# Altium schematic sheet bithd_razor.SchDoc
size A1; PageSetup: Record=PageOptions|CenterHorizontal=True|CenterVertical=True|PrintScale=1.00|XCorrection=1.00|YCorrection=1.00|PrintKind=1|BorderSize=5000000|LeftOffset=0|BottomOffset=0|Orientation=2|PaperLength=1000|PaperWidth=1000|Scale=100|PaperSource=7|PrintQuality=-4|MediaType=1|DitherType=10|PaperKind=A4|PrintScaleMode=0
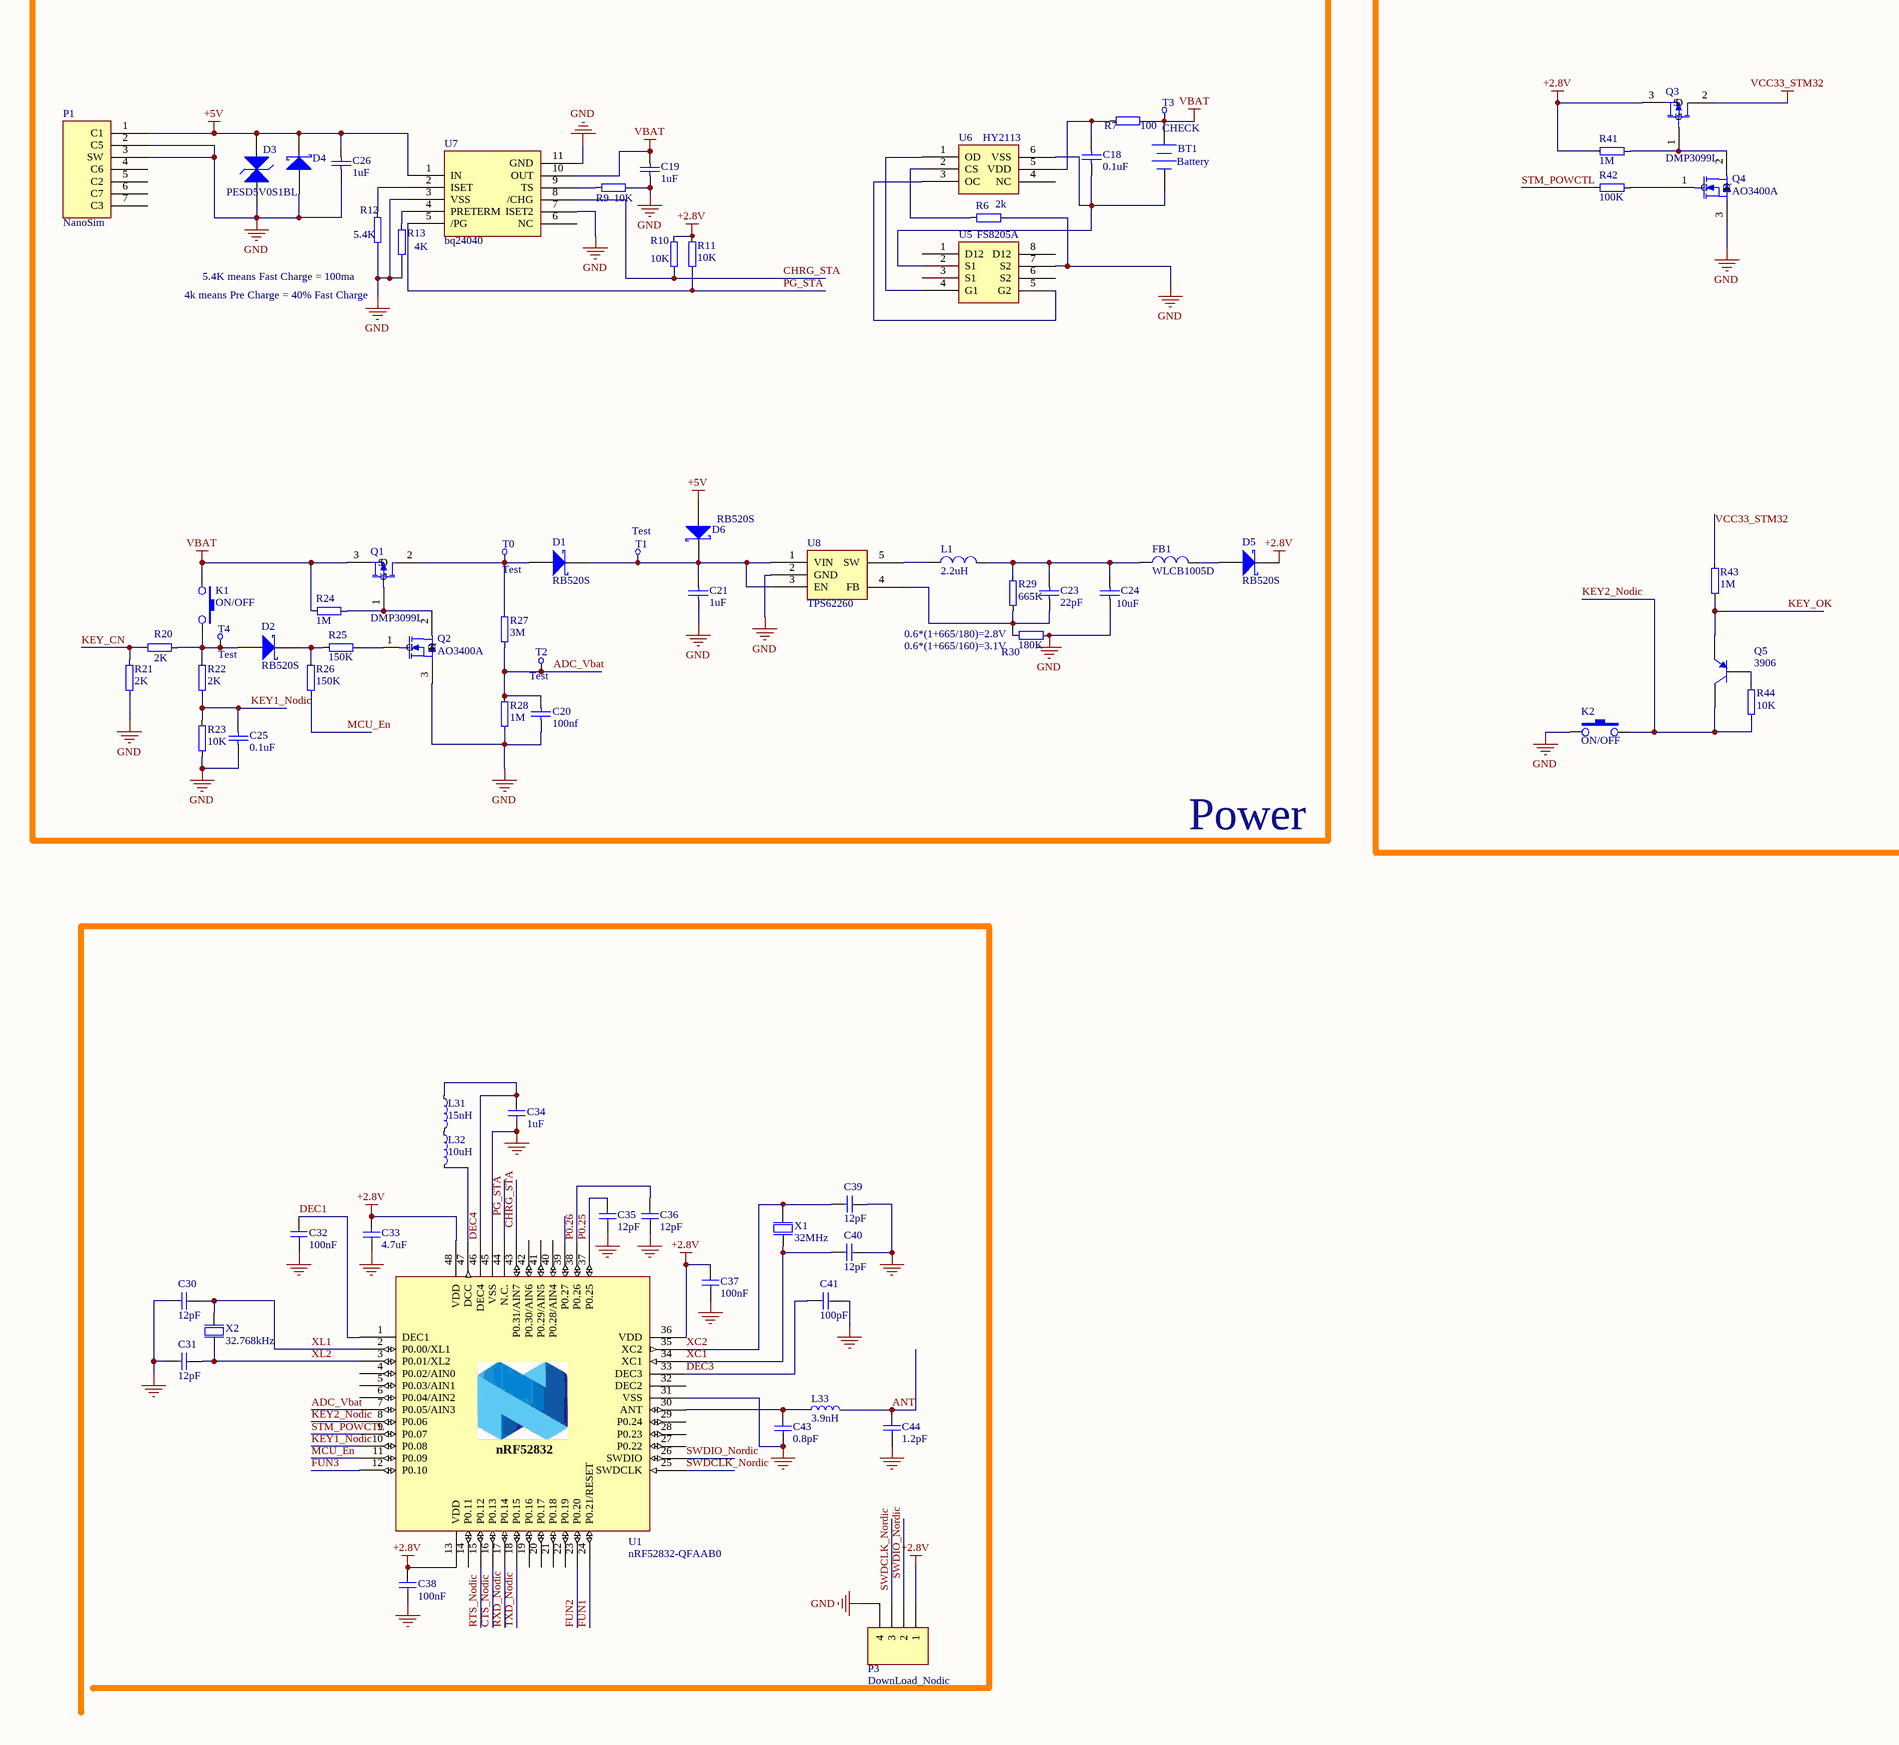
[diagram p0: bithd_razor.SchDoc, left]
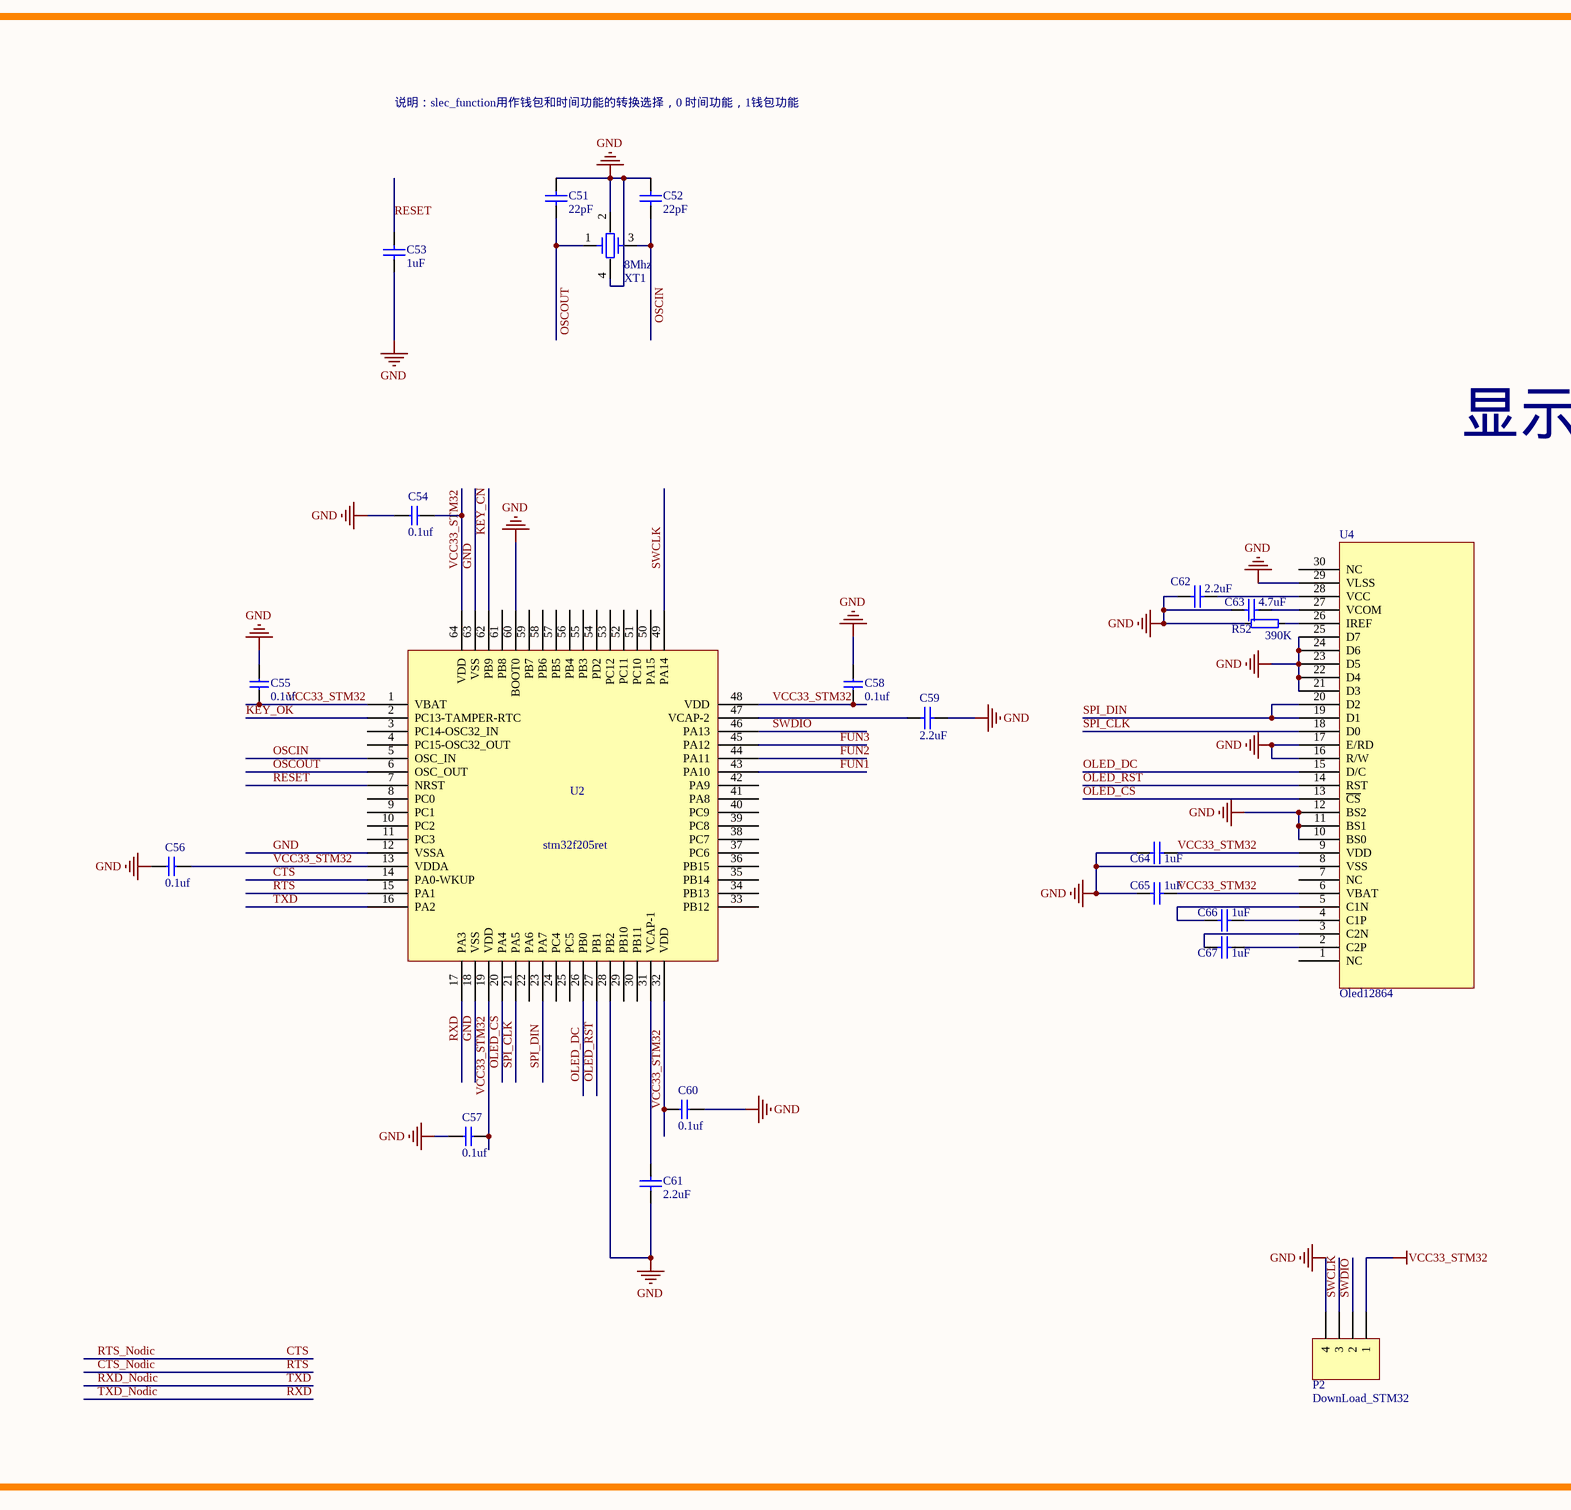
[diagram p1: bithd_razor.SchDoc, right]

## Parts
BT1  Battery  [BAT_302135]
C18  0.1uF  [0402-c]
C19  1uF  [C-RAD-0603]
C20  100nf  [0402-c]
C21  1uF  [C-RAD-0603]
C23  22pF  [0402-c]
C24  10uF  [C-RAD-0603]
C25  0.1uF  [0402-c]
C26  1uF  [C-RAD-0603]
C30  12pF  [0402-c]
C31  12pF  [0402-c]
C32  100nF  [0402-c]
C33  4.7uF  [C-RAD-0603]
C34  1uF  [C-RAD-0603]
C35  12pF  [0402-c]
C36  12pF  [0402-c]
C37  100nF  [0402-c]
C38  100nF  [0402-c]
C39  12pF  [0402-c]
C40  12pF  [0402-c]
C41  100pF  [0402-c]
C43  0.8pF  [0402-c]
C44  1.2pF  [0402-c]
C51  22pF  [0402-c]
C52  22pF  [0402-c]
C53  1uF  [C-RAD-0603]
C54  0.1uf  [0402-c]
C55  0.1uf  [0402-c]
C56  0.1uf  [0402-c]
C57  0.1uf  [0402-c]
C58  0.1uf  [0402-c]
C59  2.2uF  [C-RAD-0603]
C60  0.1uf  [0402-c]
C61  2.2uF  [C-RAD-0603]
C62  2.2uF  [C-RAD-0603]
C63  4.7uF  [C-RAD-0603]
C64  1uF  [C-RAD-0603]
C65  1uF  [C-RAD-0603]
C66  1uF  [C-RAD-0603]
C67  1uF  [C-RAD-0603]
D1  RB520S  [SOD523]
D2  RB520S  [SOD523]
D3  PESD5V0S1BL  [SOD882]
D4  PZU5.6B  [SOD323]  (value not drawn)
D5  RB520S  [SOD523]
D6  RB520S  [SOD523]
FB1  WLCB1005D  [0603-1]
K1  ON/OFF  [SMALL_KEY]
K2  ON/OFF  [SMALL_KEY]
L1  2.2uH  [0603-1]
L31  15nH  [INDC1005X04L]
L32  10uH  [0603-1]
L33  3.9nH  [INDC1005X04L]
P1  NanoSim  [NANOSIM1]
P2  DownLoad_STM32  [SWD_CON]
P3  DownLoad_Nodic  [SWD_CON]
Q1  DMP3099L  [SOT-23]
Q2  AO3400A  [SOT-23]
Q3  DMP3099L  [SOT-23]
Q4  AO3400A  [SOT-23]
Q5  3906  [SOT523]
R6  2k  [0402-A]
R7  100  [0402-A]
R9  10K  [0402-A]
R10  10K  [0402-A]
R11  10K  [0402-A]
R12  5.4K  [0402-A]
R13  4K  [0402-A]
R20  2K  [0402-A]
R21  2K  [0402-A]
R22  2K  [0402-A]
R23  10K  [0402-A]
R24  1M  [0402-A]
R25  150K  [0402-A]
R26  150K  [0402-A]
R27  3M  [0402-A]
R28  1M  [0402-A]
R29  665K  [0402-A]
R30  180K  [0402-A]
R41  1M  [0402-A]
R42  100K  [0402-A]
R43  1M  [0402-A]
R44  10K  [0402-A]
R52  390K  [0402-A]
T0  Test  [TEST_P]
T1  Test  [TEST_P]
T2  Test  [TEST_P]
T3  CHECK  [TEST_P]
T4  Test  [TEST_P]
U1  nRF52832-QFAAB0  [QFN40P600X600X90-48N]
U2  stm32f205ret  [LQFP-64]
U4  Oled12864  [oled12864_reverse]
U5  FS8205A  [TSSOP-8]
U6  HY2113  [SOT23-6]
U7  bq24040  [WSON-10]
U8  TPS62260  [SOT23-5]
X1  32MHz  [BT-XTAL_2016]
X2  32.768kHz  [XTAL_3215]
XT1  8Mhz  [SMD3225]

## Blocks framed on the sheet
Power: BT1 C18-C21 C23-C26 D1-D6 FB1 K1 L1 P1 Q1 Q2 R6 R7 R9-R13 R20-R30 T0-T4 U5-U8

## Nets
+2.8V: C33.1 C37.2 C38.2 D5.2(K) P3.1 Q3.3(S) R10.2 R11.1 R41.2 U1.13(VDD) U1.36(VDD) U1.48(VDD)
+5V: C26.1 D3.2(K) D4.2(K) D6.1(A) P1.1(C1) U7.1(IN)
GND: C19.2 C20.1 C21.1 C24.2 C25.1 C26.2 C30.2 C31.2 C32.1 C33.2 C34.1 C35.1 C36.1 C37.1 C38.1 C39.1 C40.2 C41.1 C43.2 C44.1 C51.1 C52.2 C53.1 C54.1 C55.1 C56.1 C57.2 C58.1 C59.1 C60.1 C61.1 C62.1 C63.1 C64.1 C65.1 D3.1(A) D4.1(A) K2.1 P1.2(C5) P1.3(SW) P2.4 P3.4 Q2.3(S) Q4.3(S) R6.1 R9.1 R12.2 R13.1 R21.1 R23.1 R28.1 R30.1 R52.1 U1.31(VSS) U1.45(VSS) U1.49(GND) U2.12(VSSA) U2.18(VSS) U2.28(PB2) U2.60(BOOT0) U2.63(VSS) U4.8(VSS) U4.10(BS0) U4.11(BS1) U4.12(BS2) U4.16(R/W) U4.17(E/RD) U4.21(D3) U4.22(D4) U4.23(D5) U4.24(D6) U4.25(D7) U4.29(VLSS) U5.7(S2) U7.3(VSS) U7.7(ISET2) U7.11(GND) U8.2(GND) X1.2(GND) X1.4(GND) XT1.2 XT1.4
VBAT: BT1.1(+) C19.1 K1.1 Q1.3(S) R7.2 R24.2 T3.1 U7.10(OUT)
VCC33_STM32: C54.2 C55.2 C56.2 C57.1 C58.2 C60.2 C64.2 C65.2 P2.1 Q3.2(D) R43.2 U2.1(VBAT) U2.13(VDDA) U2.19(VDD) U2.32(VDD) U2.48(VDD) U2.64(VDD) U4.6(VBAT) U4.9(VDD)
ADC_Vbat: C20.2 R27.2 R28.2 T2.1 U1.7(P0.05/AIN3)
ANT: C44.2 L33.2
CHRG_STA: R10.1 U1.43(P0.31/AIN7) U7.8(/CHG)
CTS: U1.15(P0.12) U2.14(PA0-WKUP)  [also labelled RTS_Nodic]
CTS_Nodic: U1.16(P0.13) U2.15(PA1)  [also labelled RTS]
DEC1: C32.2 U1.1(DEC1)
DEC3: C41.2 U1.33(DEC3)
DEC4: C34.2 L31.1 U1.46(DEC4)
FUN1: U1.24(P0.21/RESET) U2.43(PA10)
FUN2: U1.23(P0.20) U2.44(PA11)
FUN3: U1.12(P0.10) U2.45(PA12)
KEY1_Nodic: C25.2 R22.1 R23.2 U1.10(P0.08)
KEY2_Nodic: K2.2 Q5.3(C) R44.2 U1.8(P0.06)
KEY_CN: R20.2 R21.2 U2.62(PB9)
KEY_OK: Q5.2(E) R43.1 U2.2(PC13-TAMPER-RTC)
MCU_En: R26.1 U1.11(P0.09)
OLED_CS: U2.20(PA4) U4.13(~{CS})
OLED_DC: U2.26(PB0) U4.15(D/C)
OLED_RST: U2.27(PB1) U4.14(RST)
OSCIN: C52.1 U2.5(OSC_IN) XT1.3
OSCOUT: C51.2 U2.6(OSC_OUT) XT1.1
P0.25: C35.2 U1.37(P0.25)
P0.26: C36.2 U1.38(P0.26)
PG_STA: R11.2 U1.44(N.C.) U7.5(/PG)
RESET: C53.2 U2.7(NRST)
RXD: U1.18(P0.15) U2.17(PA3)  [also labelled TXD_Nodic]
RXD_Nodic: U1.17(P0.14) U2.16(PA2)  [also labelled TXD]
SPI_CLK: U2.21(PA5) U4.18(D0)
SPI_DIN: U2.23(PA7) U4.19(D1) U4.20(D2)
STM_POWCTL: R42.2 U1.9(P0.07)
SWCLK: P2.3 U2.49(PA14)
SWDCLK_Nordic: P3.3 U1.25(SWDCLK)
SWDIO: P2.2 U2.46(PA13)
SWDIO_Nordic: P3.2 U1.26(SWDIO)
XC1: C40.1 U1.34(XC1) X1.1(inp)
XC2: C39.2 U1.35(XC2) X1.3(out)
XL1: C30.1 U1.2(P0.00/XL1) X2.1(inp)
XL2: C31.1 U1.3(P0.01/XL2) X2.2(out)
NetBT1_2: BT1.2(-) C18.2 U5.2(S1) U6.6(VSS)
NetC18_1: C18.1 R7.1 U6.5(VDD)
NetC21_2: C21.2 D1.2(K) D6.2(K) T1.1 U8.1(VIN) U8.3(EN)
NetC23_1: C23.1 C24.1 FB1.1 L1.2 R29.1
NetC23_2: C23.2 R29.2 R30.2 U8.4(FB)
NetC43_1: C43.1 L33.1 U1.30(ANT)
NetC59_2: C59.2 U2.47(VCAP-2)
NetC61_2: C61.2 U2.31(VCAP-1)
NetC62_2: C62.2 U4.28(VCC)
NetC63_2: C63.2 U4.27(VCOM)
NetC66_1: C66.1 U4.5(C1N)
NetC66_2: C66.2 U4.4(C1P)
NetC67_1: C67.1 U4.3(C2N)
NetC67_2: C67.2 U4.2(C2P)
NetD1_1: D1.1(A) Q1.2(D) R27.1 T0.1
NetD2_1: D2.1(A) K1.2 R20.1 R22.2 T4.1
NetD2_2: D2.2(K) R25.2 R26.2
NetD5_1: D5.1(A) FB1.2
NetL1_1: L1.1 U8.5(SW)
NetL31_2: L31.2 L32.1
NetL32_2: L32.2 U1.47(DCC)
NetQ1_1: Q1.1(G) Q2.2(D) R24.1
NetQ2_1: Q2.1(G) R25.1
NetQ3_1: Q3.1(G) Q4.2(D) R41.1
NetQ4_1: Q4.1(G) R42.1
NetQ5_1: Q5.1(B) R44.1
NetR6_2: R6.2 U6.2(CS)
NetR9_2: R9.2 U7.9(TS)
NetR12_1: R12.1 U7.2(ISET)
NetR13_2: R13.2 U7.4(PRETERM)
NetR52_2: R52.2 U4.26(IREF)
NetU5_4: U5.4(G1) U6.1(OD)
NetU5_5: U5.5(G2) U6.3(OC)

Not connected (* = marked no-connect by the designer): P1 4(C6) 5(C2) 6(C7) 7(C3); U1 4(P0.02/AIN0) 5(P0.03/AIN1) 6(P0.04/AIN2) 14(P0.11) 19(P0.16) 20(P0.17) 21(P0.18) 22(P0.19) 27(P0.22) 28(P0.23) 29(P0.24) 32(DEC2) 39(P0.27) 40(P0.28/AIN4) 41(P0.29/AIN5) 42(P0.30/AIN6); U2 3(PC14-OSC32_IN) 4(PC15-OSC32_OUT) 8(PC0) 9(PC1) 10(PC2) 11(PC3) 22(PA6) 24(PC4) 25(PC5) 29(PB10) 30(PB11) 33(PB12) 34(PB13) 35(PB14) 36(PB15) 37(PC6) 38(PC7) 39(PC8) 40(PC9) 41(PA8) 42(PA9) 50(PA15) 51(PC10) 52(PC11) 53(PC12) 54(PD2) 55(PB3) 56(PB4) 57(PB5) 58(PB6) 59(PB7) 61(PB8); U4 1(NC) 7(NC) 30(NC); U5 1(D12) 3(S1) 6(S2) 8(D12); U6 4(NC); U7 6(NC)

## Notes on the sheet
- 说明：slec_function用作钱包和时间功能的转换选择，0 时间功能，1钱包功能
- 5.4K means Fast Charge = 100ma
- 4k means Pre Charge = 40% Fast Charge
- 显示
- (near R30) 0.6*(1+665/180)=2.8V
- (near R30) 0.6*(1+665/160)=3.1V
- (in symbol nRF52832-QFAAB0) nRF52832

## Library data of the parts
BT1 = Battery: 备份电池; Published: 24-Mar-1999; LatestRevisionDate: 17-Jul-2002; LatestRevisionNote: Re-released for DXP Platform.; PackageReference: BAT-2; Publisher: Altium Limited
C18-C21 C23-C26 C51-C53 C59 C66 C67 = Cap: 无极性电容; Published: 8-Jun-2000; LatestRevisionDate: 17-Jul-2002; LatestRevisionNote: Re-released for DXP Platform.; PackageReference: RAD-0.3; Publisher: Altium Limited
  C18 C25: Value: 0.1uF
  C19 C26: Value: 1uF
  C23: Value: 22pF
  C24: Value: 10uF
C30 C31 C35 C36 C39 C40 = C0402-12p: Capacitor, NP0, ?%; Part number IPS: 00000002398; Note: 50V; Artikkelnr Noca: 20029159; Artikkelnr Simpro: N.A.; Part Number: C0402-12p; Manufacturer: *; Manufacturer Part Number: *; Datasheet: *; LatestRevisionDate: 2011-05-11; Pin Count: 2; Publisher: Nordic Semiconductor; Published: 2009-05-08; Value: 12pF; Supplier: *; Supplier part number: *; 2nd source Supplier: *; 2nd source part number: *; Footprint Doc: 0402
C32 C37 C38 = C0402-100n: Capacitor, X7R, ?0%; Part number IPS: 00000005296; Note: 16V; Artikkelnr Noca: 20039200; Artikkelnr Simpro: N.A.; Part Number: C0402-100n; Manufacturer: *; Manufacturer Part Number: *; Datasheet: *; LatestRevisionDate: 2009-11-23; Pin Count: 2; Publisher: Nordic Semiconductor; Published: 2009-05-08; Value: 100nF; Supplier: *; Supplier part number: *; 2nd source Supplier: *; 2nd source part number: *; Footprint Doc: 0402
C33 = C0603-4?: Capacitor, X5R, ?0%; Part number IPS: 00000003141; Value: 4.7µF; Note: 6.3V; Artikkelnr Noca: 20069060; Artikkelnr Simpro: N.A.; Part Number: C0603-4?; Manufacturer: *; Manufacturer Part Number: *; Datasheet: *; LatestRevisionDate: 2009-11-23; Pin Count: 2; Publisher: Nordic Semiconductor; Published: 2009-05-08; Supplier: *; Supplier part number: *; 2nd source Supplier: *; 2nd source part number: *; Footprint Doc: 0603
C34 = C0603-1?: Capacitor, X7R, ?0%; Part number IPS: 00000000616; Value: 1.0uF; Note: 16V; Artikkelnr Noca: 20039335; Artikkelnr Simpro: N.A.; Part Number: C0603-1?; Manufacturer: *; Manufacturer Part Number: *; Datasheet: *; LatestRevisionDate: 2013-06-05; Pin Count: 2; Publisher: Nordic Semiconductor; Published: 2009-05-08; Supplier: *; Supplier part number: *; 2nd source Supplier: *; 2nd source part number: *; Footprint Doc: 0603
C41 = C0402-100p: Capacitor, NP0, ?%; Part number IPS: 00000002361; Note: 50V; Artikkelnr Noca: 20029135; Artikkelnr Simpro: N.A.; Part Number: C0402-100p; Manufacturer: *; Manufacturer Part Number: *; Datasheet: *; LatestRevisionDate: 2009-05-08; Pin Count: 2; Publisher: Nordic Semiconductor; Published: 2009-05-08; Value: 100pF; Supplier: *; Supplier part number: *; 2nd source Supplier: *; 2nd source part number: *; Footprint Doc: 0402
C43 = C0402-0.8p: Capacitor, NP0, ?%; Note: 50V; Artikkelnr Noca: 20029147; Artikkelnr Simpro: N.A.; Part Number: C0402-0.8p; Manufacturer: *; Manufacturer Part Number: *; Datasheet: *; LatestRevisionDate: 2012-11-21; Pin Count: 2; Publisher: Nordic Semiconductor; Published: 2009-05-08; Value: 0.8pF; Supplier: *; Supplier part number: *; 2nd source Supplier: *; 2nd source part number: *; Footprint Doc: 0402
C44 = C0402-1.2p: Capacitor, NP0, ?.1pF; Part number IPS: 00000005410; Note: 50V; Artikkelnr Noca: 20029157; Artikkelnr Simpro: N.A.; Part Number: C0402-1.2p; Manufacturer: *; Manufacturer Part Number: *; Datasheet: *; LatestRevisionDate: 2011-05-11; Pin Count: 2; Publisher: Nordic Semiconductor; Published: 2009-05-08; Value: 1.2pF; Supplier: *; Supplier part number: *; 2nd source Supplier: *; 2nd source part number: *; Footprint Doc: 0402
C54-C58 C60 = CAP: Capacitor, X7R, ?0%; Part Number: C0402-100n; Value: 100nF; Note: 16V; Artikkelnr Noca: 20039200; Manufacturer: *; Manufacturer Part Number: *; Datasheet: *; Footprint: 0402; LatestRevisionDate: 2009-11-23; Pin Count: 2; Publisher: Nordic Semiconductor; Published: 2009-05-08; Supplier: *; Supplier part number: *; 2nd source Supplier: *; 2nd source part number: *
C61-C65 = Cap: 无极性电容; Value: 100nF; Published: 8-Jun-2000; LatestRevisionDate: 17-Jul-2002; LatestRevisionNote: Re-released for DXP Platform.; PackageReference: RAD-0.3; Publisher: Altium Limited
D1 D2 D5 D6 = D-Schottky: 肖特基二极管; Type: SS14; Published: 8-Jun-2000; LatestRevisionDate: 17-Jul-2002; LatestRevisionNote: Re-released for DXP Platform.; PackageReference: SMB; Publisher: Altium Limited; Code_JEDEC: DO-214-AA
D3 = TVS_DIOCODE: TVS
D4 = D-Schottky: 齐纳二极管; Published: 8-Jun-2000; LatestRevisionDate: 17-Jul-2002; LatestRevisionNote: Re-released for DXP Platform.; PackageReference: SMB; Publisher: Altium Limited; Code_JEDEC: DO-214-AA
FB1 = Inductor: magnetic bead; Code_IEC: 1005; Published: 8-Jun-2000; LatestRevisionDate: 17-Jul-2002; LatestRevisionNote: Re-released for DXP Platform.; PackageReference: 0402-A; Publisher: Altium Limited; Code_JEITA: 0402; Value: WLCB1005D
K1 K2 = KEY
L1 = Inductor: inductance; Code_IEC: 1005; Published: 8-Jun-2000; LatestRevisionDate: 17-Jul-2002; LatestRevisionNote: Re-released for DXP Platform.; PackageReference: 0402-A; Publisher: Altium Limited; Code_JEITA: 0402; Value: 2.2uH
L31 = L0402-15n: Inductor, 320mA, ?%; Manufacturer: Taiyo Yuden; Manufacturer Part Number: HK100515NJ-T; 2nd source part number: 658-1328; Note: High frequency chip inductor ?0%; Artikkelnr Noca: 33029323; Artikkelnr Simpro: N.A.; Part Number: L0402-15n; LatestRevisionDate: 2012-09-19; Pin Count: 2; Publisher: Nordic Semiconductor; Published: 2010-07-12; Value: 15nH; Supplier: Digi-Key; Datasheet: http://www.yuden.co.jp/productdata/catalog/en/mlci04_e.pdf; Supplier part number: 587-1521-1-ND; 2nd source Supplier: Farnell; Footprint Doc: 0402; ComponentLink1Description: Datasheet; ComponentLink2Description: Supplier link
L32 = L0603-10?: Inductor, 80mA, ?0%; Manufacturer: Taiyo Yuden; Manufacturer Part Number: LBMF1608T100K; 2nd source part number: 178-6105; Note: LBMF1608T100K 10µH 80mA 0603; Artikkelnr Noca: 33029314; Artikkelnr Simpro: N.A.; Part Number: L0603-10?; Datasheet: http://www.yuden.co.jp/ut/product/pdf/elb2_e.pdf; LatestRevisionDate: 2012-09-19; Pin Count: 2; Publisher: Nordic Semiconductor; Published: 2010-02-24; Value: 10uH; Supplier: Digi-Key; Supplier part number: 587-1714-1-ND; 2nd source Supplier: Farnell; Footprint Doc: 0603; ComponentLink1Description: Datasheet; ComponentLink2Description: Supplier link
L33 = L0402-3n9: Inductor, 170mA, ?.1nH; Manufacturer: Murata; Manufacturer Part Number: LQP15MN3N9B02D; Note: High frequency chip inductor ?%; Artikkelnr Noca: 33029151; Artikkelnr Simpro: N.A.; Part Number: L0402-3n9; Datasheet: http://search.murata.co.jp/Ceramy/image/img/PDF/ENG/L0075S0084LQP15M.pdf; LatestRevisionDate: 2012-09-19; Pin Count: 2; Publisher: Nordic Semiconductor; Published: 2009-05-08; Value: 3.9nH; Supplier: Digi-Key; Supplier part number: 490-1131-1-ND; 2nd source Supplier: *; 2nd source part number: *; Footprint Doc: 0402; ComponentLink1Description: Datasheet; ComponentLink2Description: Supplier link
P2 P3 = Header 4: Header, 4-Pin; LatestRevisionDate: 17-Jul-2002; LatestRevisionNote: Re-released for DXP Platform.; Publisher: Altium Limited
Q1 Q3 = MOSFET-P: P-Channel MOSFET; PackageDocument: 1995/1996; Published: 8-Jun-2000; LatestRevisionDate: 17-Jul-2002; LatestRevisionNote: Re-released for DXP Platform.; PackageReference: E3; Publisher: Altium Limited
Q2 Q4 = MOSFET-N: N-Channel MOSFET; PackageDocument: 1995/1996; Published: 8-Jun-2000; LatestRevisionDate: 17-Jul-2002; LatestRevisionNote: Re-released for DXP Platform.; PackageReference: E3; Publisher: Altium Limited
Q5 = 2N3906: PNP General Purpose Amplifier; Published: 8-Jun-2000; LatestRevisionDate: 15-Jan-2003; LatestRevisionNote: PCB Footprint 'BCY-W3/D4.7' replaced; DatasheetDocument: 1997; PackageDocument: Sep-1998; PackageReference: TO-92A; Publisher: Altium Limited; Code_JEDEC: TO-92A; ComponentLink1Description: Manufacturer Link; ComponentLink1URL: http://www.fairchildsemi.com/; ComponentLink2Description: Datasheet; ComponentLink2URL: http://www.fairchildsemi.com/ds/2N%2F2N3906.pdf
R6 R7 R9-R13 R20-R30 R41-R44 R52 = R-10K: resistor
T0-T4 = CHECK: 测试点
U1 = nRF52832-QFAAB0: Multi-protocol Bluetooth Low Energy, ANT and 2.4GHz proprietary system-on-chip; Manufacturer: Nordic Semiconductor; Artikkelnr Noca: 15079334; Artikkelnr Simpro: N.A.; Part Number: nRF52832-QFAAB0; Manufacturer Part Number: nRF52832-QFAAB0; Datasheet: *; LatestRevisionDate: 2016-08-25; Pin Count: 48; Publisher: Nordic Semiconductor; Published: 2016-08-25; Value: nRF52832-QFAAB0; Note: *; Supplier: Nordic Semiconductor; Supplier part number: nRF52832-QFAAB0; 2nd source Supplier: *; 2nd source part number: *; Footprint Doc: QFN-48
U5 = FS8205A: Charger IC
U6 = HY2113: Charger
U7 = bq24040: Charge
X1 = XTAL_SMD2016_32MHz_8pF_Epson: XTAL SMD 2016, 32MHz, Cl=8pF, Tol: ?0ppm, Stab: ?0ppm; Manufacturer: Epson Toyocom; Manufacturer Part Number: Q22FA12800025; Note: XTAL SMD 32.000MHz; Artikkelnr Noca: 22019238; Artikkelnr Simpro: N.A.; Part Number: XTAL_SMD2016_32MHz_8pF_Epson; Datasheet: http://www.epsondevice.com/docs/qd/en/DownloadServlet?id=ID000449; LatestRevisionDate: 2014-11-27; Pin Count: 4; Publisher: Nordic Semiconductor; Published: 2012-03-09; Value: 32MHz; Supplier: Farnell; Supplier part number: 171-2806; 2nd source Supplier: *; 2nd source part number: *; Footprint Doc: XTAL_2016
X2 = XTAL_FC-135 32.768k: XTAL SMD 3215, 32.768kHz, 9pF, ?0ppm; Manufacturer: Epson Toyocom; Manufacturer Part Number: FC-135 32.768KHZ ?0PPM,9.0PF; 2nd source part number: 127-8037; Note: XTAL SMD 32.768kHz, 3215; Artikkelnr Noca: 22019091; Artikkelnr Simpro: N.A.; Part Number: XTAL_FC-135 32.768k; Datasheet: http://www.farnell.com/datasheets/57480.pdf; LatestRevisionDate: 2014-03-27; Pin Count: 2; Publisher: Nordic Semiconductor; Published: 2010-10-18; Value: 32.768kHz; Supplier: Digi-Key; Supplier part number: FC-135 32.7680KA-AC-ND; 2nd source Supplier: Farnell; Footprint Doc: XTAL_3215
XT1 = XT: 晶振